# Altium schematic sheet led-monitoring-SN74LVC540A.SchDoc
size A4
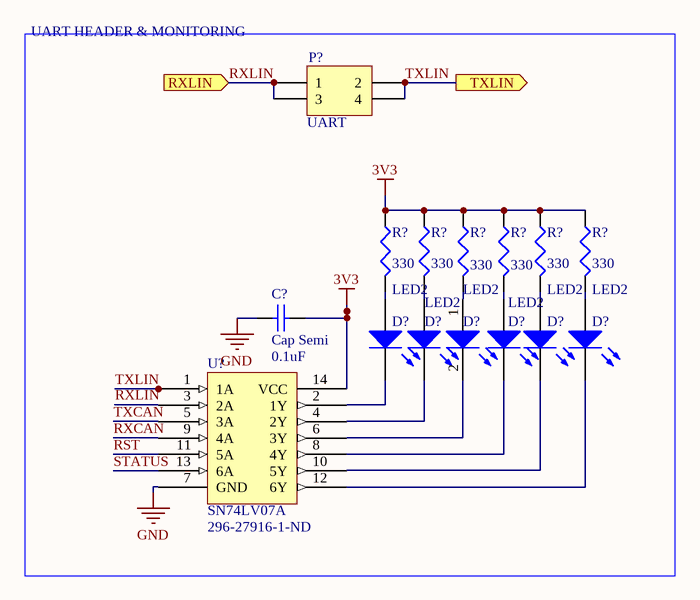
[diagram p0: led-monitoring-SN74LVC540A.SchDoc]

## Parts
(Parts that share a designator on the sheet are numbered #1, #2 ... from top to bottom, then left to right.)
C?  Cap Semi  value 0.1uF  [1608[0603]]
D?#1  LED2  [0603-LED]
D?#2  LED2  [0603-LED]
D?#3  LED2  [0603-LED]
D?#4  LED2  [0603-LED]
D?#5  LED2  [0603-LED]
D?#6  LED2  [0603-LED]
P?  UART  [HDR2X2]
R?#1  330  [J1-0603]
R?#2  330  [J1-0603]
R?#3  330  [J1-0603]
R?#4  330  [J1-0603]
R?#5  330  [J1-0603]
R?#6  330  [J1-0603]
U?  SN74LV07A  Supplier Part Number: 296-27916-1-ND  [SOP65P640X120-14N]

## Blocks framed on the sheet
UART HEADER & MONITORING: C? D?#1-D?#6 P? R?#1-R?#6 U?

## Ports
RXLIN (in), TXLIN (out)

## Nets
3V3: C?.2 R?#1.1 R?#2.1 R?#3.1 R?#4.1 R?#5.1 R?#6.1 U?.14(VCC)
GND: C?.1 U?.7(GND)
RST: U?.11(5A)
RXCAN: U?.9(4A)
RXLIN: P?.1 P?.3 U?.3(2A) ; port RXLIN
STATUS: U?.13(6A)
TXCAN: U?.5(3A)
TXLIN: P?.2 P?.4 U?.1(1A) ; port TXLIN
NetD?#1_1: D?#1.1(A) R?#1.2
NetD?#1_2: D?#1.2(K) U?.2(1Y)
NetD?#2_1: D?#2.1(A) R?#2.2
NetD?#2_2: D?#2.2(K) U?.4(2Y)
NetD?#3_1: D?#3.1(A) R?#3.2
NetD?#3_2: D?#3.2(K) U?.6(3Y)
NetD?#4_1: D?#4.1(A) R?#4.2
NetD?#4_2: D?#4.2(K) U?.8(4Y)
NetD?#5_1: D?#5.1(A) R?#5.2
NetD?#5_2: D?#5.2(K) U?.10(5Y)
NetD?#6_1: D?#6.1(A) R?#6.2
NetD?#6_2: D?#6.2(K) U?.12(6Y)

## Library data of the parts
C? = Cap Semi: Capacitor (Semiconductor SIM Model); Published: 8-Jun-2000; LatestRevisionDate: 29-May-2009; LatestRevisionNote: IPC-7351 Footprint Added.; PackageReference: C1206; Publisher: Altium Limited; PackageDescription: Chip Capacitor
D?#1-D?#6 = LED2: Typical RED, GREEN, YELLOW, AMBER GaAs LED; Published: 8-Jun-2000; LatestRevisionDate: 17-Jul-2002; LatestRevisionNote: Re-released for DXP Platform.; PackageVersion: Feb-2002; PackageReference: 3.2X1.6X1.1; Publisher: Altium Limited; PackageDescription: SM LED; 2 Flat Leads; Supplier: Digi-Key
P? = Header 2X2: Header, 2-Pin, Dual row; LatestRevisionDate: 17-Jul-2002; LatestRevisionNote: Re-released for DXP Platform.; Publisher: Altium Limited; Supplier: Digi-Key
R?#1-R?#6 = Res3: Resistor; Published: 8-Jun-2000; LatestRevisionDate: 29-May-2009; LatestRevisionNote: IPC-7351 Footprint Added.; PackageReference: J1-0603; Publisher: Altium Limited; PackageDescription: Chip Resistor; Value: 330; Supplier: Digi-Key
U? = SN74LV07A: Six element 1-bit non-inverting open-drain buffer.; Supplier: Digi-Key